# Altium project Ant_Robot.PrjPCB
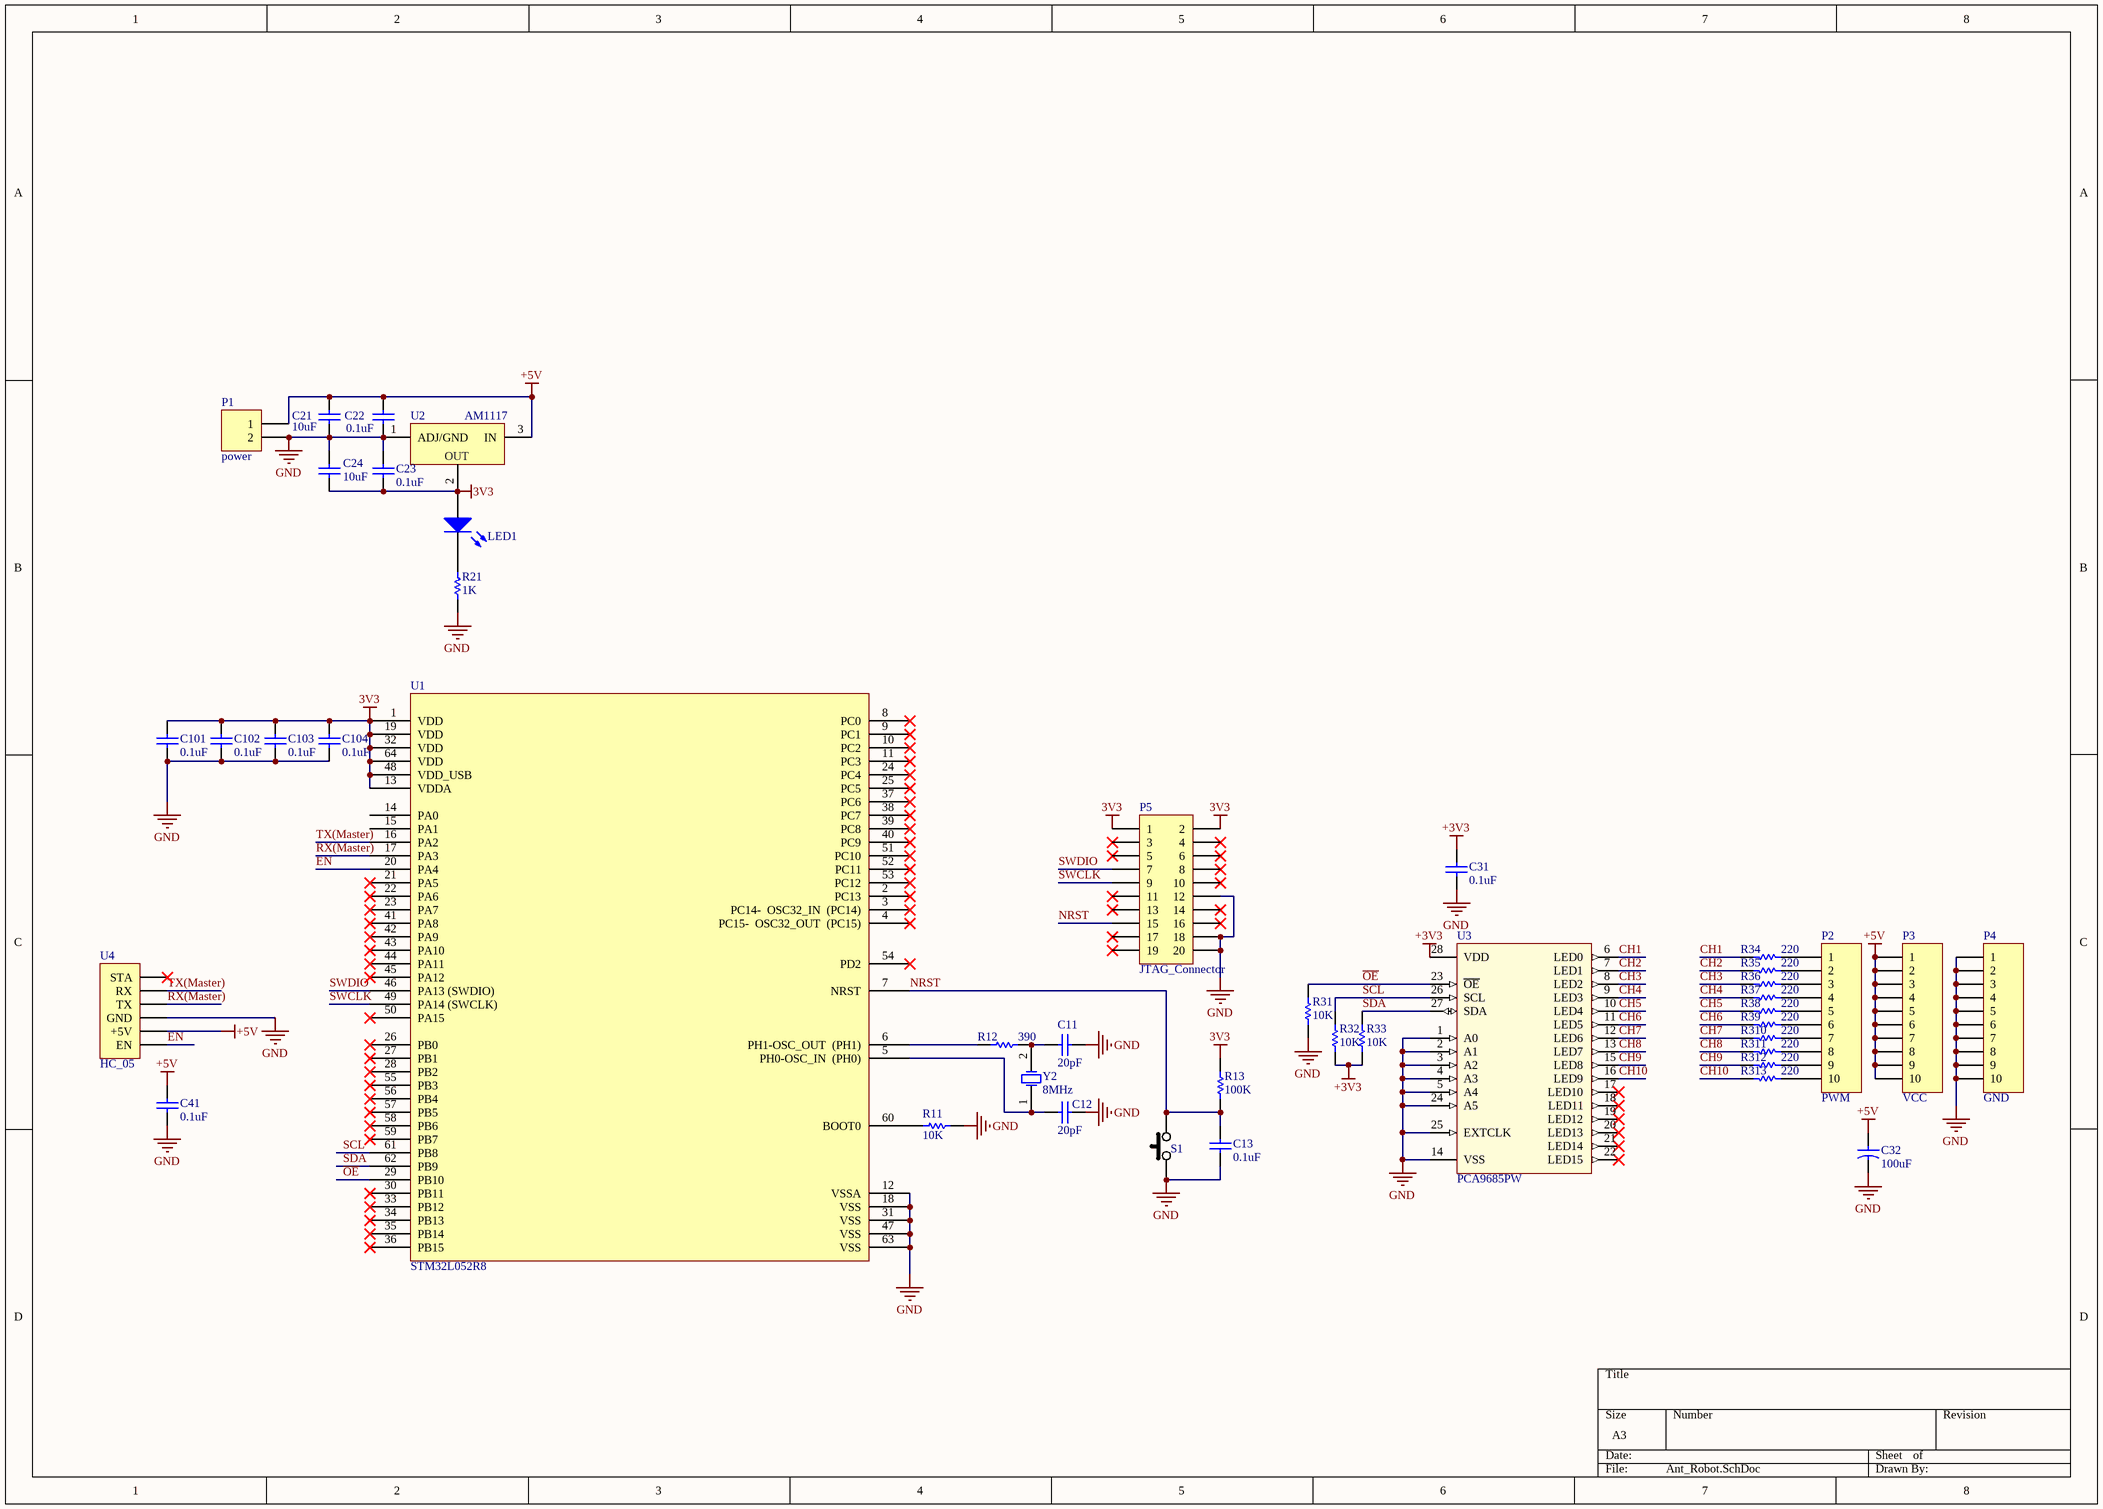
[diagram p0: Ant_Robot.SchDoc]
1 sheet, 43 parts. Net scope: global (net labels, ports and power ports of the same name join across sheets).
Board file: Ant_Robot.PcbDoc

## Sheet Ant_Robot.SchDoc
size A3

### Parts
C11  20pF  [SMD 0805]
C12  20pF  [SMD 0805]
C13  0.1uF  [SMD 0805]
C21  10uF  [SMD 0805]
C22  0.1uF  [SMD 0805]
C23  0.1uF  [SMD 0805]
C24  10uF  [SMD 0805]
C31  0.1uF  [SMD 0805]
C32  100uF  [C2]
C41  0.1uF  [SMD 0805]
C101  0.1uF  [SMD 0805]
C102  0.1uF  [SMD 0805]
C103  0.1uF  [SMD 0805]
C104  0.1uF  [SMD 0805]
LED1  LED  [SMD 0805]  (value not drawn)
P1  power  [HDR1X2 - 5mm]
P2  PWM  [HDR1X10]
P3  VCC  [HDR1X10]
P4  GND  [HDR1X10]
P5  JTAG_Connector  [JTAG_PIN_20]
R11  value 10K  [SMD 0805]  (hidden comment: R1)
R12  value 390  [SMD 0805]  (hidden comment: R1)
R13  value 100K  [SMD 0805]  (hidden comment: R1)
R21  value 1K  [SMD 0805]  (hidden comment: R1)
R31  value 10K  [SMD 0805]  (hidden comment: R1)
R32  value 10K  [SMD 0805]  (hidden comment: R1)
R33  value 10K  [SMD 0805]  (hidden comment: R1)
R34  value 220  [SMD 0805]  (hidden comment: R1)
R35  value 220  [SMD 0805]  (hidden comment: R1)
R36  value 220  [SMD 0805]  (hidden comment: R1)
R37  value 220  [SMD 0805]  (hidden comment: R1)
R38  value 220  [SMD 0805]  (hidden comment: R1)
R39  value 220  [SMD 0805]  (hidden comment: R1)
R310  value 220  [SMD 0805]  (hidden comment: R1)
R311  value 220  [SMD 0805]  (hidden comment: R1)
R312  value 220  [SMD 0805]  (hidden comment: R1)
R313  value 220  [SMD 0805]  (hidden comment: R1)
S1  SW  [SW]  (value not drawn)
U1  STM32L052R8  [LQFP64_N]
U2  AM1117  [SOT-223]
U3  PCA9685PW  [TSSOP28]
U4  HC_05  [HDR1X6]
Y2  8MHz  [XTAL4-8]

### Nets
3V3: C23.1 C24.1 C101.2 C102.2 C103.2 C104.2 LED1.1(A) P5.1 P5.2 R13.2 U1.1(VDD) U1.13(VDDA) U1.19(VDD) U1.32(VDD) U1.48(VDD_USB) U1.64(VDD) U2.2(OUT)
+3V3: C31.2 R32.1 R33.1 U3.28(VDD)
+5V: C21.2 C22.2 C32.1 C41.2 P1.1 P3.1 P3.2 P3.3 P3.4 P3.5 P3.6 P3.7 P3.8 P3.9 P3.10 U2.3(IN) U4.5(+5V)
GND: C11.1 C12.1 C13.2 C21.1 C22.1 C23.2 C24.2 C31.1 C32.2 C41.1 C101.1 C102.1 C103.1 C104.1 P1.2 P4.1 P4.2 P4.3 P4.4 P4.5 P4.6 P4.7 P4.8 P4.9 P4.10 P5.12 P5.18 P5.20 R11.2 R21.1 R31.1 S1.2 U1.12(VSSA) U1.18(VSS) U1.31(VSS) U1.47(VSS) U1.63(VSS) U2.1(ADJ/GND) U3.1(A0) U3.2(A1) U3.3(A2) U3.4(A3) U3.5(A4) U3.14(VSS) U3.24(A5) U3.25(EXTCLK) U4.4(GND)
CH1: R34.2 U3.6(LED0)
CH2: R35.2 U3.7(LED1)
CH3: R36.2 U3.8(LED2)
CH4: R37.2 U3.9(LED3)
CH5: R38.2 U3.10(LED4)
CH6: R39.2 U3.11(LED5)
CH7: R310.2 U3.12(LED6)
CH8: R311.2 U3.13(LED7)
CH9: R312.2 U3.15(LED8)
CH10: R313.2 U3.16(LED9)
EN: U1.20(PA4) U4.6(EN)
NRST: C13.1 P5.15 R13.1 S1.1 U1.7(NRST)
~{OE}: R31.2 U1.29(PB10) U3.23(~{OE})
RX(Master): U1.17(PA3) U4.3(TX)
SCL: R32.2 U1.61(PB8) U3.26(SCL)
SDA: R33.2 U1.62(PB9) U3.27(SDA)
SWCLK: P5.9 U1.49(PA14_(SWCLK))
SWDIO: P5.7 U1.46(PA13_(SWDIO))
TX(Master): U1.16(PA2) U4.2(RX)
NetC11_2: C11.2 R12.2 Y2.2(OSC2)
NetC12_2: C12.2 U1.5(PH0-OSC_IN__(PH0)) Y2.1(OSC1)
NetLED1_2: LED1.2(K) R21.2
NetP2_1: P2.1 R34.1
NetP2_2: P2.2 R35.1
NetP2_3: P2.3 R36.1
NetP2_4: P2.4 R37.1
NetP2_5: P2.5 R38.1
NetP2_6: P2.6 R39.1
NetP2_7: P2.7 R310.1
NetP2_8: P2.8 R311.1
NetP2_9: P2.9 R312.1
NetP2_10: P2.10 R313.1
NetR11_1: R11.1 U1.60(BOOT0)
NetR12_1: R12.1 U1.6(PH1-OSC_OUT__(PH1))

Not connected (* = marked no-connect by the designer): P5 3* 4* 5* 6* 8* 10* 11* 13* 14* 16* 17* 19*; U1 2(PC13)* 3(PC14-__OSC32_IN__(PC14))* 4(PC15-__OSC32_OUT__(PC15))* 8(PC0)* 9(PC1)* 10(PC2)* 11(PC3)* 14(PA0) 15(PA1) 21(PA5)* 22(PA6)* 23(PA7)* 24(PC4)* 25(PC5)* 26(PB0)* 27(PB1)* 28(PB2)* 30(PB11)* 33(PB12)* 34(PB13)* 35(PB14)* 36(PB15)* 37(PC6)* 38(PC7)* 39(PC8)* 40(PC9)* 41(PA8)* 42(PA9)* 43(PA10)* 44(PA11)* 45(PA12)* 50(PA15)* 51(PC10)* 52(PC11)* 53(PC12)* 54(PD2)* 55(PB3)* 56(PB4)* 57(PB5)* 58(PB6)* 59(PB7)*; U3 17(LED10)* 18(LED11)* 19(LED12)* 20(LED13)* 21(LED14)* 22(LED15)*; U4 1(STA)*

### Library data of the parts
C11-C13 C21-C24 C31 C41 C101-C104 = C1 陶瓷
C32 = C2 電解
P1 = Header 2: Header, 2-Pin; LatestRevisionDate: 17-Jul-2002; LatestRevisionNote: Re-released for DXP Platform.; Publisher: Altium Limited
P2-P4 = Header 10: Header, 10-Pin; LatestRevisionDate: 17-Jul-2002; LatestRevisionNote: Re-released for DXP Platform.; Publisher: Altium Limited
R11-R13 R21 R31-R39 R310-R313 = R1: Resistor; Published: 8-Jun-2000; LatestRevisionDate: 17-Jul-2002; LatestRevisionNote: Re-released for DXP Platform.; PackageReference: AXIAL-0.3; Publisher: Altium Limited; PackageDescription: Axial Device, Thru-Hole; 2 Leads; 0.3 in Pin Spacing
U3 = PCA9685PW: 16Bits PWM Channel
U4 = Header 6: Header, 6-Pin; LatestRevisionDate: 17-Jul-2002; LatestRevisionNote: Re-released for DXP Platform.; Publisher: Altium Limited
Y2 = XTAL: Crystal Oscillator; Published: 8-Jun-2000; LatestRevisionDate: 17-Jul-2002; LatestRevisionNote: Re-released for DXP Platform.; PackageReference: R38; Publisher: Altium Limited